# EAGLE design Microkeyboard tht (EAGLE 9.6.2)
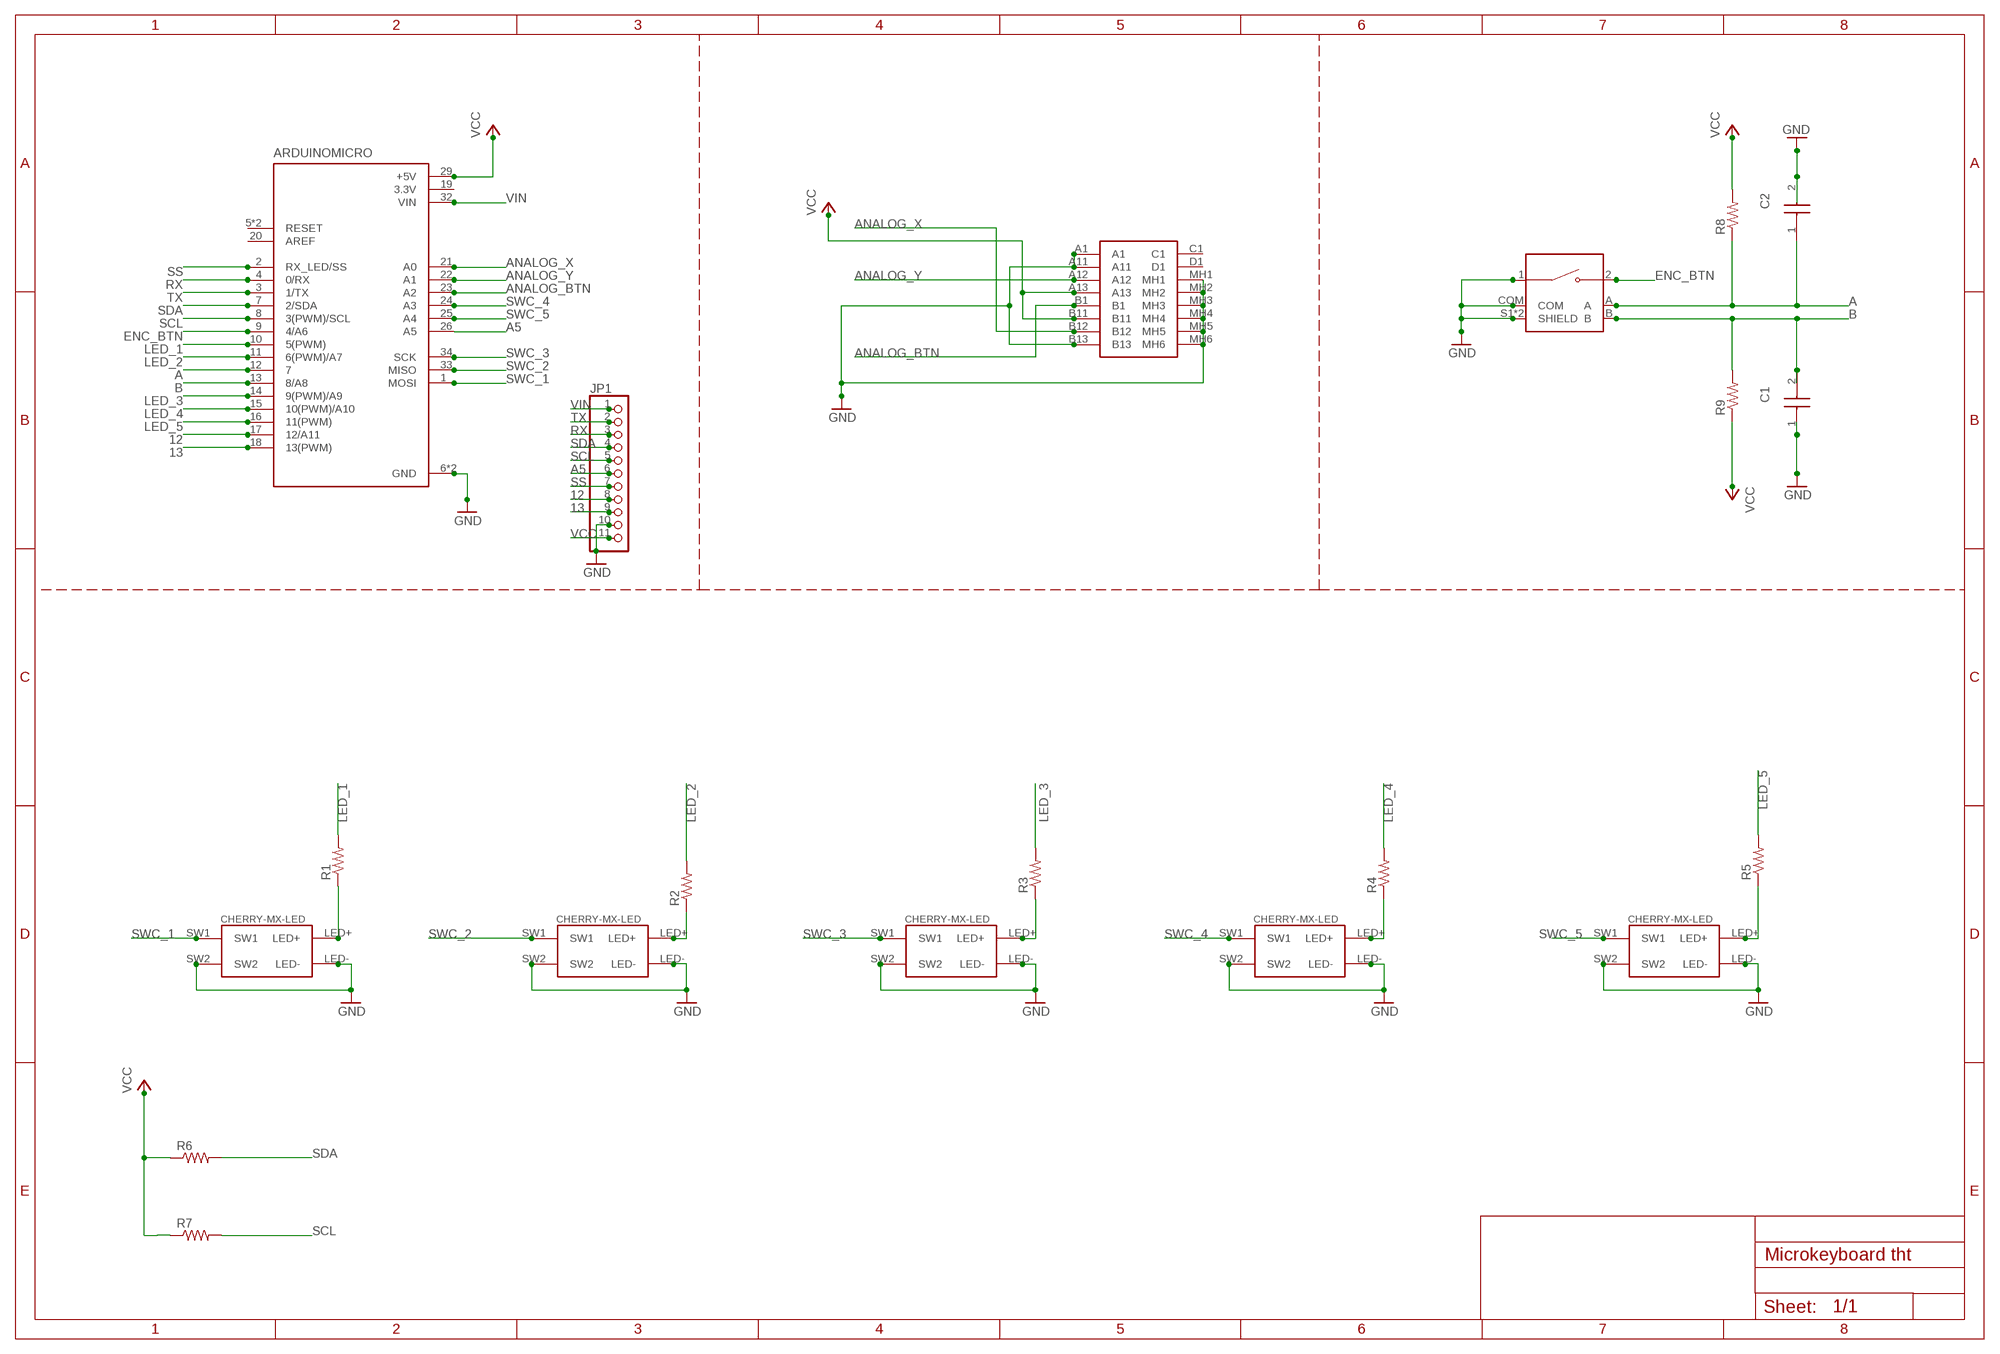
[diagram p0: schematic, sheet 1]

## Parts
ARDUINOMICRO  A000053  [ARDUINO_A000053]
C1  FG26X7R2E104KNT06  [FG26]
C2  FG26X7R2E104KNT06  [FG26]
JP1  PINHD-1X11  [1X11]
MT1  PEC11R-4215F-S0024  [XDCR_PEC11R-4215F-S0024]
R1  R-US_0207/10  [0207/10]
R2  R-US_0207/10  [0207/10]
R3  R-US_0207/10  [0207/10]
R4  R-US_0207/10  [0207/10]
R5  R-US_0207/10  [0207/10]
R6  R-US_0207/10  [0207/10]
R7  R-US_0207/10  [0207/10]
R8  R-US_0207/10  [0207/10]
R9  R-US_0207/10  [0207/10]
S1  RKJXV122400R  [RKJXV122400R]
SWC_1  SWC_1  CHERRY-MX-LED  [CHERRY-MX-LED]
U$1  CHERRY-MX-LED  [CHERRY-MX-LED]
U$2  CHERRY-MX-LED  [CHERRY-MX-LED]
U$3  CHERRY-MX-LED  [CHERRY-MX-LED]
U$5  CHERRY-MX-LED  [CHERRY-MX-LED]

## Nets
12: ARDUINOMICRO.17(12/A11) JP1.8
13: ARDUINOMICRO.18(13(PWM)) JP1.9
A: ARDUINOMICRO.12 C2.1 MT1.A R8.1
A5: ARDUINOMICRO.26(A5) JP1.6
ANALOG_BTN: ARDUINOMICRO.23(A2) S1.B1
ANALOG_X: ARDUINOMICRO.21(A0) S1.B12
ANALOG_Y: ARDUINOMICRO.22(A1) S1.A12
B: ARDUINOMICRO.13(8/A8) C1.2 MT1.B R9.2
ENC_BTN: ARDUINOMICRO.9(4/A6) MT1.2
GND: ARDUINOMICRO.6(GND) ARDUINOMICRO.31(GND) C1.1 C2.2 JP1.10 MT1.1 MT1.COM MT1.S1(SHIELD) MT1.S2(SHIELD) S1.A1 S1.A11 S1.B13 S1.MH1 S1.MH2 S1.MH3 S1.MH4 S1.MH5 S1.MH6 SWC_1.LED- SWC_1.SW2 U$1.LED- U$1.SW2 U$2.LED- U$2.SW2 U$3.LED- U$3.SW2 U$5.LED- U$5.SW2
LED_1: ARDUINOMICRO.10(5(PWM)) R1.2
LED_2: ARDUINOMICRO.11(6(PWM)/A7) R2.2
LED_3: ARDUINOMICRO.14(9(PWM)/A9) R3.2
LED_4: ARDUINOMICRO.15(10(PWM)/A10) R4.2
LED_5: ARDUINOMICRO.16(11(PWM)) R5.2
N$1: R1.1 SWC_1.LED+
N$2: R5.1 U$3.LED+
N$3: R3.1 U$1.LED+
N$4: R2.1 U$5.LED+
N$5: R4.1 U$2.LED+
RX: ARDUINOMICRO.4(0/RX) JP1.3
SCL: ARDUINOMICRO.8(3(PWM)/SCL) JP1.5 R7.2
SDA: ARDUINOMICRO.7(2/SDA) JP1.4 R6.2
SS: ARDUINOMICRO.2(RX_LED/SS) JP1.7
SWC_1: ARDUINOMICRO.1(MOSI) SWC_1.SW1
SWC_2: ARDUINOMICRO.33(MISO) U$5.SW1
SWC_3: ARDUINOMICRO.34(SCK) U$1.SW1
SWC_4: ARDUINOMICRO.24(A3) U$2.SW1
SWC_5: ARDUINOMICRO.25(A4) U$3.SW1
TX: ARDUINOMICRO.3(1/TX) JP1.2
VCC: ARDUINOMICRO.29(+5V) JP1.11 R6.1 R7.1 R8.2 R9.1 S1.A13 S1.B11
VIN: ARDUINOMICRO.32(VIN) JP1.1
Unconnected: ARDUINOMICRO.5(RESET) ARDUINOMICRO.20(AREF) ARDUINOMICRO.30(RESET) S1.C1 S1.D1

## Power pins joined to a net without a drawn wire
3.3V: ARDUINOMICRO.19(3.3V)

## Library data of the parts
ARDUINOMICRO = A000053:A000053: MCU, ARDUINO MICRO, LEONARDO BASED, ATMEGA32u4, 5V, USB-MICRO Check availability <https://pricing.snapeda.com/parts/Arduino%20Micro/Arduino/view-part?ref=eda>; AVAILABILITY: Not in stock; DESCRIPTION: Microcontroller board based on the ATmega32u4; MF: Arduino; MP: Arduino Micro; PACKAGE: Non-Standard Arduino; PRICE: None
C1 C2 = FG26X7R2E104KNT06:FG26X7R2E104KNT06: MLCC with Dipped Radial Lead, Capacitance=0.1?F, LxWxT:5.5x6x3.5mm, Lead pitch:5mm Source: Datasheet <https://product.tdk.com/system/files/dam/doc/product/capacitor/ceramic/lead-mlcc/catalog/leadmlcc_halogenfree_fg_en.pdf>; DESCRIPTION: MLCC with Dipped Radial Lead, Capacitance=0.1?F, LxWxT:5.5x6x3.5mm, Lead pitch:5mm; HEIGHT: 6mm; MANUFACTURER_NAME: TDK; MANUFACTURER_PART_NUMBER: FG26X7R2E104KNT06; MOUSER_PART_NUMBER: 810-FG26X7R2E104KNT6; MOUSER_PRICE-STOCK: https://www.mouser.co.uk/ProductDetail/TDK/FG26X7R2E104KNT06/?qs=qf2ddTMq67X6lbGhIP3UFw%3D%3D
JP1 = pinhead:PINHD-1X11: PIN HEADER
MT1 = PEC11R-4215F-S0024:PEC11R-4215F-S0024: Incremental Encoder, 12 Mm, Contact Rating 10 Ma - 5 Vdc Check availability <https://pricing.snapeda.com/parts/PEC11R-4215F-S0024/Bourns/view-part?ref=eda>; AVAILABILITY: In Stock; DESCRIPTION: Rotary Encoder Mechanical 24 Quadrature (Incremental) Vertical; MF: Bourns; MP: PEC11R-4215F-S0024; PACKAGE: None; PRICE: None; PURCHASE-URL: https://pricing.snapeda.com/search/part/PEC11R-4215F-S0024/?ref=eda
R1-R9 = adafruit:R-US_: RESISTOR, American symbol
S1 = RKJXV122400R:RKJXV122400R: RKJXV122400R Source: Datasheet <https://tech.alpsalpine.com/prod/e/html/multicontrol/potentiometer/rkjxk/rkjxv122400r.html>; DESCRIPTION: RKJXV122400R; HEIGHT: 18.95mm; MANUFACTURER_NAME: ALPS Electric; MANUFACTURER_PART_NUMBER: RKJXV122400R; MOUSER_PART_NUMBER: 688-RKJXV122400R; MOUSER_PRICE-STOCK: https://www.mouser.co.uk/ProductDetail/Alps-Alpine/RKJXV122400R?qs=GedFDFLaBXEbB%252ByoOVwLBg%3D%3D
SWC_1 U$1-U$3 U$5 = cherrymx:CHERRY-MX-LED: Cherry MX series keyswitch with LED

## Board
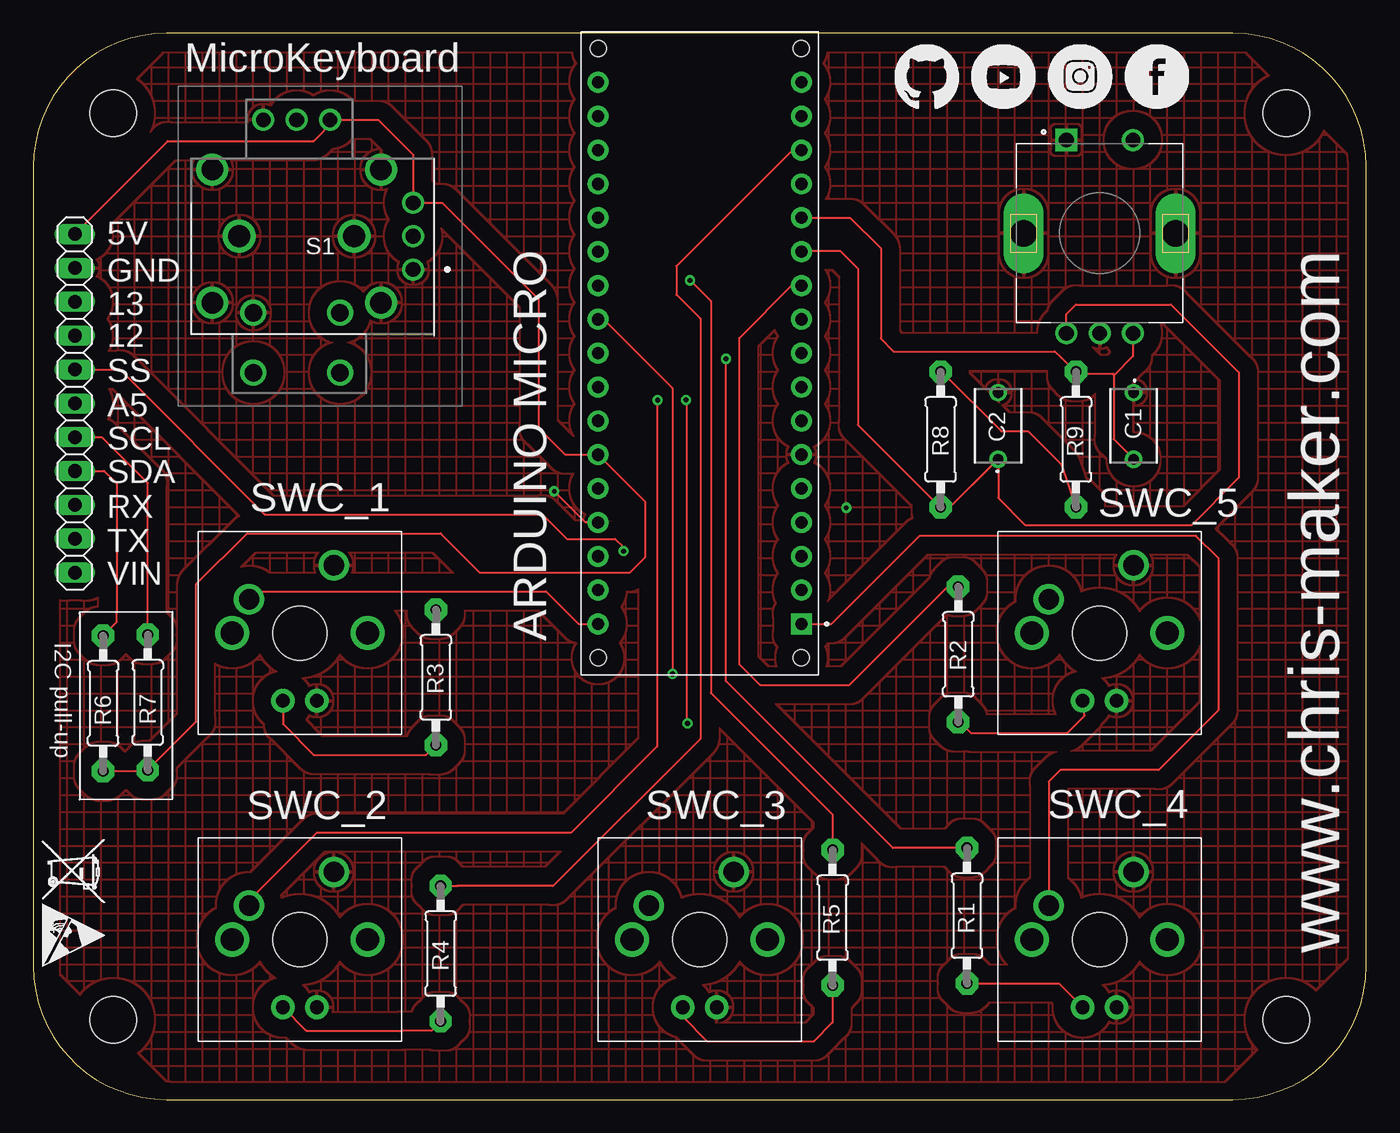
[diagram p1: board, top side]
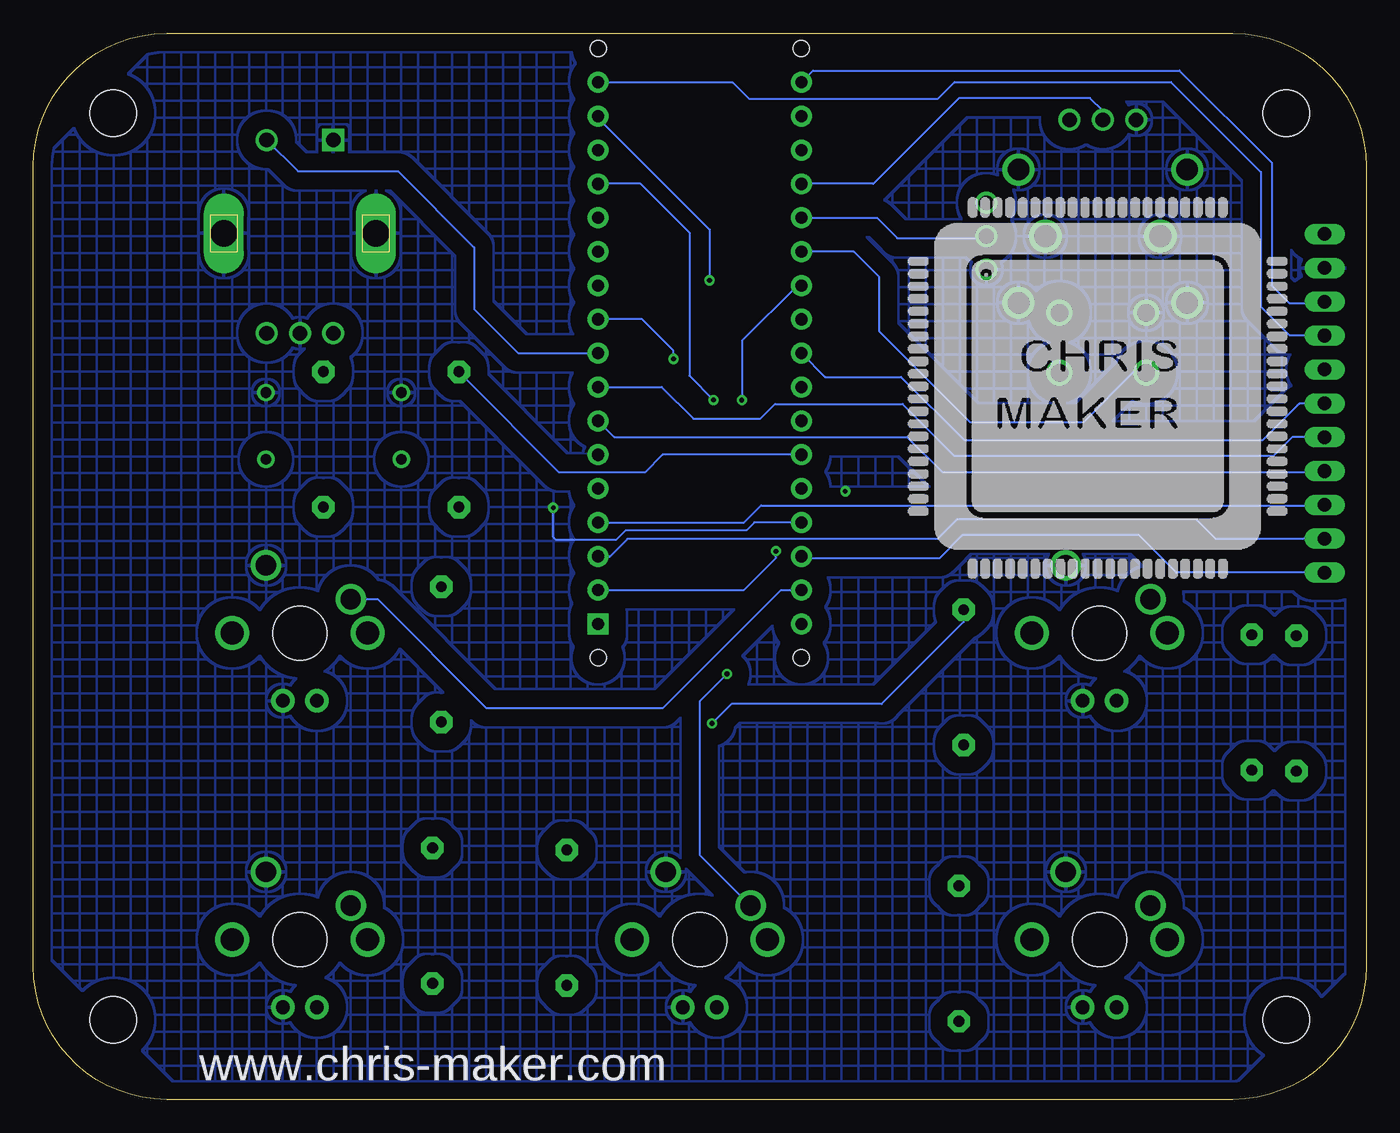
[diagram p2: board, bottom side, seen from below]

Size 100 x 80 mm. Coordinates in mm from the lower left corner, seen from the top.
Outline: 0,10 arc90 10,0 90,0 arc90 100,10 100,70 arc90 90,80 10,80 arc90 0,70 0,10
Copper layers (1*16): Top 0.035mm / dielectric 1.5mm / Bottom 0.035mm
Design rules "default": minimum track width 6mil, minimum drill 0.35mm, track to track 6mil, track to pad 6mil, pad to pad 6mil, via to via 6mil, smd to smd 6mil, copper to edge 40mil, drill to drill 6mil, minimum pad ring 10mil, minimum via ring 8mil, stop-mask expansion 4mil, vias tented up to drill 0mil, thermal gap 10mil
Holes 3.5 mm at 6,74 6,6 94,6 94,74

### Footprints (pad centres in the part's own frame; a part is rotated, then mirrored left to right if it is on the bottom)
ARDUINO_A000053 = drill 0.914 pad 1.575 square: 1 -7.62,20.32 | drill 0.914 pad 1.575: 2 -7.62,17.78; 3 -7.62,15.24; 4 -7.62,12.7; 5 -7.62,10.16; 6 -7.62,7.62; 7 -7.62,5.08; 8 -7.62,2.54; 9 -7.62,0; 10 -7.62,-2.54; 11 -7.62,-5.08; 12 -7.62,-7.62; 13 -7.62,-10.16; 14 -7.62,-12.7; 15 -7.62,-15.24; 16 -7.62,-17.78; 17 -7.62,-20.32; 18 7.62,-20.32; 19 7.62,-17.78; 20 7.62,-15.24; 21 7.62,-12.7; 22 7.62,-10.16; 23 7.62,-7.62; 24 7.62,-5.08; 25 7.62,-2.54; 26 7.62,0; 27 7.62,2.54; 28 7.62,5.08; 29 7.62,7.62; 30 7.62,10.16; 31 7.62,12.7; 32 7.62,15.24; 33 7.62,17.78; 34 7.62,20.32 | hole 1.2: -7.62,-22.86; 7.62,-22.86; -7.62,22.86; 7.62,22.86
FG26 = drill 0.8 pad 1.3: 1 -2.5,0; 2 2.5,0
1X11 = drill 1.016 long: 1 -12.7,0; 2 -10.16,0; 3 -7.62,0; 4 -5.08,0; 5 -2.54,0; 6 0,0; 7 2.54,0; 8 5.08,0; 9 7.62,0; 10 10.16,0; 11 12.7,0
XDCR_PEC11R-4215F-S0024 = drill 1.1 square: 1 -2.5,7 | drill 1.1: 2 2.5,7; A -2.5,-7.5; B 2.5,-7.5; COM 0,-7.5 | drill 2 long: S1 -5.7,0; S2 5.7,0
0207/10 = drill 0.813 pad 1.676 octagon: 1 -5.08,0; 2 5.08,0
RKJXV122400R = drill 1.3 pad 1.95: A1 -11.98,-3.25; B1 -11.98,-7.75; C1 -5.48,-3.25; D1 -5.48,-7.75 | drill 1.1 pad 1.65: A11 0,0; A12 0,2.5; A13 0,5; B11 -6.23,11.23; B12 -8.73,11.23; B13 -11.23,11.23 | drill 1.6 pad 2.4: MH1 -15.055,-2.5; MH2 -15.055,7.5; MH3 -2.405,-2.5; MH4 -2.405,7.5 | drill 1.65 pad 2.475: MH5 -13.03,2.5; MH6 -4.43,2.5
CHERRY-MX-LED = drill 1.016 pad 1.778: LED+ -1.27,-5.08; LED- 1.27,-5.08 | drill 1.714 pad 1.93: P$3 -5.08,0; P$4 5.08,0 | drill 1.524 pad 2.286: SW1 -3.81,2.54; SW2 2.54,5.08 | hole 4.064: 0,0

### Placement (x,y rotation side)
ARDUINOMICRO  50,56 180 top
C1  82.55,50.55 270 top
C2  72.39,50.55 90 top
JP1  3.11,52.24 90 top
MT1  80,65 0 top
R1  70.05,13.79 90 top
R2  69.39,33.4 90 top
R3  30.2,31.67 90 top
R4  30.56,10.95 90 top
R5  59.97,13.64 90 top
R6  5.23,29.72 90 top
R7  8.59,29.79 90 top
R8  68.07,49.53 90 top
R9  78.23,49.53 90 top
S1  28.49,62.28 0 top
SWC_1  80,12 0 top
U$1  20,35 0 top
U$2  20,12 0 top
U$3  50,12 0 top
U$5  80,35 0 top

### Tracks (layer width: path | path; a pad name or v marks a point on that pad's centre or on a via)
12
  Bottom 0.152: ARDUINOMICRO.17 47.54,76.32 46.32,75.1 32.12,75.1 30.88,76.34 14.64,76.34 7.9,69.6 7.9,59.48 5.77,57.34 5.34,57.34 4.39,57.34 4.36,57.32 JP1.8
13
  Bottom 0.152: ARDUINOMICRO.18 41.49,77.21 14,77.21 7.1,70.31 7.1,61.07 5.77,59.74 5.2,59.74 4.58,59.74 4.47,59.86 JP1.9
A
  Top 0.152: MT1.A 77.5,58.92 78.24,59.66 85.35,59.66 90.45,54.56 90.45,46.67 86.86,43.09 74.45,43.09 72.39,45.14 C2.1 | ARDUINOMICRO.12 57.69,63.69 60.52,63.69 61.86,62.34 61.86,50.62 68.41,44.07 C2.1 | C2.1 72.39,48.08 68.71,44.41 R8.1
A5
  Bottom 0.152: ARDUINOMICRO.26 40.6,54.22 34.89,54.22 30.15,49.48 7.75,49.48 5.18,52.06 5,52.24 JP1.6
ANALOG_BTN
  Bottom 0.152: ARDUINOMICRO.23 38.44,63.62 36.53,61.71 36.53,57.63 29.7,50.81 21.23,50.81 17.5,54.53 S1.B1
ANALOG_X
  Bottom 0.152: ARDUINOMICRO.21 36.98,68.7 30.55,75.13 20.72,75.13 19.76,74.18 S1.B12
ANALOG_Y
  Bottom 0.152: ARDUINOMICRO.22 36.72,66.16 35.18,64.62 28.65,64.62 S1.A12
B
  Top 0.152: 81.05,54.33 81.05,54.46 78.31,54.46 77.11,55.66 | 81.05,54.33 81.05,49.54 C1.2 | ARDUINOMICRO.13 61.28,66.16 63.58,63.87 63.58,57.11 64.55,56.14 76.63,56.14 77.11,55.66 | MT1.B 82.5,55.77 81.05,54.33 | R9.2 77.11,55.66
ENC_BTN
  Bottom 0.152: MT1.2 80.15,69.65 72.63,69.65 66.92,63.93 66.92,59.29 63.62,56 ARDUINOMICRO.9
GND  (via drill 0.35)
  Top 0.152: ARDUINOMICRO.31 41.42,43.3 v39.08,45.64
  Bottom 0.152: ARDUINOMICRO.31 45.91,43.3 46.5,42.71 55.55,42.71 56.26,42 60.8,42 61,42.2 v61,44.4
  pour Top (isolate 1.27, hatched): 1.97,70.83 1.97,9.35 10.23,1.08 89.2,1.08 99.08,10.96 99.08,70.49 91.01,78.56 9.7,78.56
  pour Bottom (isolate 1.27, hatched): 10.13,78.8 1.57,70.24 1.57,9.39 9.87,1.08 89.32,1.08 98.84,10.6 98.84,71.09 91.13,78.8
LED_1  (via drill 0.35)
  Top 0.152: v51.97,55.57 51.96,55.56 51.96,31.4 64.48,18.87 R1.2
  Bottom 0.152: v51.97,55.57 51.97,56.19 54.32,58.54 ARDUINOMICRO.10
LED_2
  Top 0.152: ARDUINOMICRO.11 57.56,61.14 56.97,61.14 52.97,57.15 52.97,32.64 54.55,31.07 61.2,31.07 68.64,38.5 68.78,38.5 68.81,38.48 R2.2
LED_3  (via drill 0.35)
  Top 0.152: v48.97,52.5 49.02,52.44 49.02,28.27 v49.08,28.21
  Bottom 0.152: ARDUINOMICRO.14 54.43,68.7 50.79,65.06 50.79,54.31 v48.97,52.5 | v49.08,28.21 47.62,29.67 36.35,29.67 30.2,35.82 R3.2
LED_4
  Top 0.152: ARDUINOMICRO.15 56.94,71.24 48.24,62.54 48.24,60.39 50.04,58.59 50.04,27.07 38.98,16.01 31.8,16.01 31.79,16.03 R4.2
LED_5  (via drill 0.35)
  Top 0.152: v49.26,61.47 50.84,59.89 50.84,30.49 59.99,21.34 59.99,19.2 59.97,19.18 R5.2
  Bottom 0.152: v49.26,61.47 49.26,65.27 57.62,73.63 ARDUINOMICRO.16
N$1
  Top 0.152: SWC_1.LED+ 76.94,8.71 R1.1
N$2
  Top 0.152: U$3.LED+ 48.73,6.19 50.57,4.35 58.54,4.35 59.97,5.78 R5.1
N$3
  Top 0.152: U$1.LED+ 18.73,28.18 21.07,25.83 29.44,25.83 R3.1
N$4
  Top 0.152: U$5.LED+ 78.86,29.79 78.86,28.8 77.58,27.52 70.33,27.52 69.53,28.32 R2.1
N$5
  Top 0.152: U$2.LED+ 20.48,5.17 27.66,5.17 29.86,5.17 R4.1
RX
  Bottom 0.152: ARDUINOMICRO.4 46.67,43.3 45.4,44.57 4.29,44.57 4.25,44.62 JP1.3
SCL
  Top 0.152: R7.2 8.59,46.26 5.15,49.7 JP1.5
  Bottom 0.152: ARDUINOMICRO.8 52.87,53.46 50.49,51.08 45.46,51.08 44.35,52.19 34.79,52.19 30.91,48.31 6.93,48.31 5.53,49.72 3.13,49.72 JP1.5
SDA
  Top 0.152: JP1.4 5.3,47.16 5.31,47.17 6.27,46.21 6.27,37.19 6.27,36.54 6.27,35.84 R6.2
  Bottom 0.152: ARDUINOMICRO.7 56.42,49.72 34.44,49.72 31.79,47.07 4.38,47.07 4.28,47.17 4.27,47.16 JP1.4
SS  (via drill 0.35)
  Top 0.152: v44.28,41.14 44.28,41.44 43.65,42.07 40.03,42.07 38.19,43.9 17.36,43.9 6.65,54.61 6.49,54.78 JP1.7
  Bottom 0.152: ARDUINOMICRO.2 46.7,38.22 44.28,40.64 v44.28,41.14
SWC_1
  Top 0.152: ARDUINOMICRO.1 59.87,35.68 66.48,42.3 87.24,42.3 88.91,40.62 88.91,29.2 84.43,24.72 77.06,24.72 76.19,23.85 SWC_1.SW1
SWC_2
  Bottom 0.152: U$5.SW1 74.18,37.54 66.02,29.38 52.76,29.38 43.91,38.22 ARDUINOMICRO.33
SWC_3
  Top 0.152: U$1.SW1 16.77,38.12 38.47,38.12 40.91,35.68 ARDUINOMICRO.34
SWC_4  (via drill 0.35)
  Top 0.152: v46.85,52.49 46.8,52.49 46.8,26.48 40.34,20.02 21.27,20.02 16.19,14.94 U$2.SW1
  Bottom 0.152: ARDUINOMICRO.24 42.67,61.08 46.82,56.94 46.82,52.52 v46.85,52.49
SWC_5  (via drill 0.35)
  Top 0.152: ARDUINOMICRO.25 42.78,58.54 47.95,53.37 v47.95,31.94 | v47.95,31.94
  Bottom 0.152: U$3.SW1 50,18.35 50,29.88 v47.95,31.94
TX
  Bottom 0.152: ARDUINOMICRO.3 56.73,40.76 55.42,42.07 32.16,42.07 30.7,43.53 12.74,43.53 11.28,42.07 4.7,42.07 4.69,42.08 JP1.2
VCC
  Top 0.152: S1.B11 22.62,73.51 | 22.62,73.51 25.88,73.51 28.49,70.9 S1.A13 30.66,67.28 37.9,60.04 37.9,50.38 39.9,48.38 ARDUINOMICRO.29 45.89,44.87 45.89,40.67 44.73,39.51 33.54,39.51 30.56,42.48 16.05,42.48 12.23,38.66 12.23,28.36 R7.1 8.51,24.64 R6.1 | 22.62,73.51 21.02,71.91 10.08,71.91 JP1.11 | R8.2 68.2,54.56 72.62,50.14 74.62,50.14 77.11,47.65 R9.1
  Bottom 0.152: ARDUINOMICRO.29 52.78,48.38 54.1,47.06 60.56,47.06 67.66,54.16 67.72,54.16 68.07,54.51 R8.2
VIN
  Bottom 0.152: ARDUINOMICRO.32 42.22,40.6 32.02,40.6 30.28,42.34 17.05,42.34 14.24,39.53 14.24,39.54 JP1.1

### Text on the board
tPlace: MicroKeyboard | ARDUINO MICRO | www.chris-maker.com
bPlace: www.chris-maker.com
tNames: 5V | GND | 13 | 12 | SS | A5 | SCL | SDA | RX | SWC_1 | SWC_5 | TX | VIN | I2C pull-up | SWC_2 | SWC_3 | SWC_4